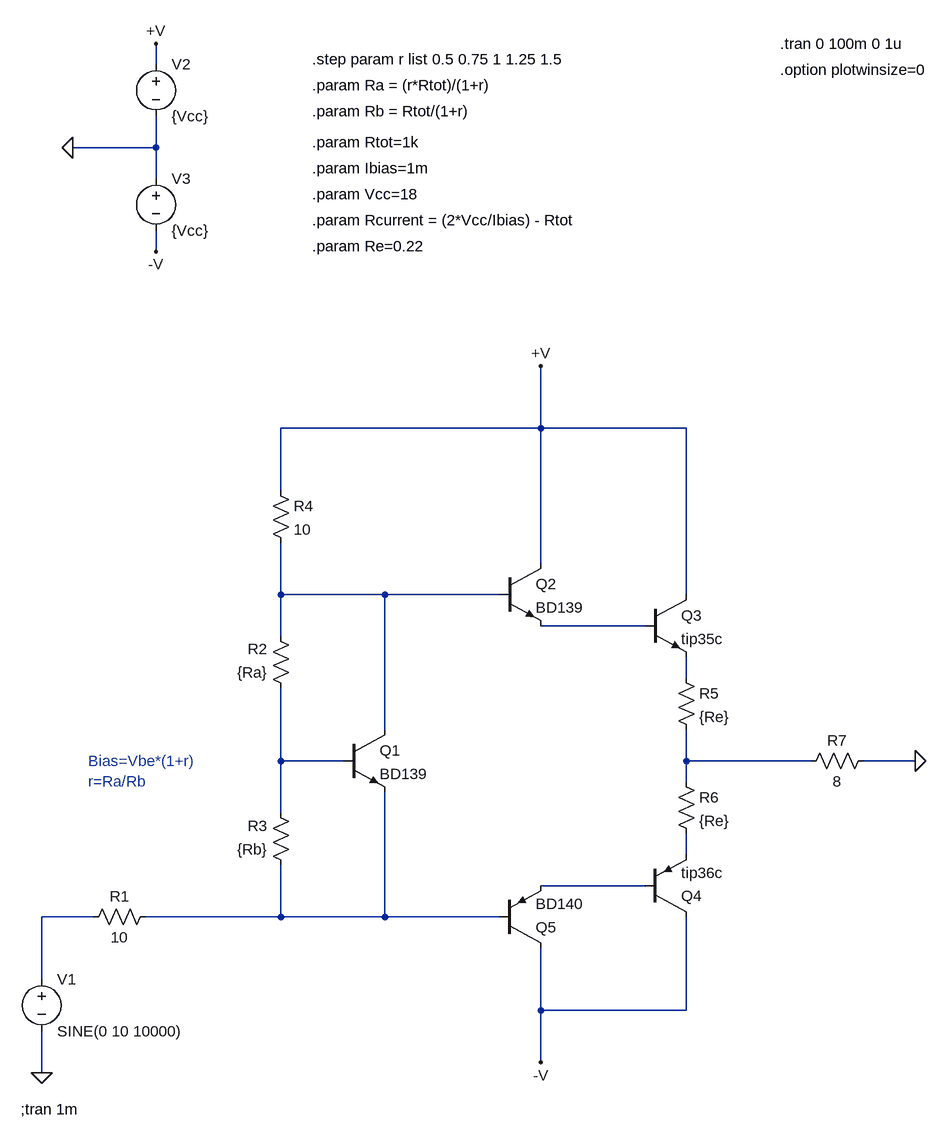
[diagram p0: schematic Bias voltage.asc]
Bias voltage.asc, the LTspice schematic file:
Version 4
SHEET 1 1524 680
WIRE 208 -976 208 -1008
WIRE 208 -848 208 -896
WIRE 208 -848 80 -848
WIRE 208 -800 208 -848
WIRE 208 -688 208 -720
WIRE 800 -416 800 -512
WIRE 800 -416 400 -416
WIRE 1024 -416 800 -416
WIRE 400 -320 400 -416
WIRE 800 -208 800 -416
WIRE 400 -160 400 -240
WIRE 560 -160 400 -160
WIRE 736 -160 560 -160
WIRE 1024 -160 1024 -416
WIRE 960 -112 800 -112
WIRE 400 -96 400 -160
WIRE 1024 -32 1024 -64
WIRE 560 48 560 -160
WIRE 400 96 400 -16
WIRE 496 96 400 96
WIRE 1024 96 1024 48
WIRE 1216 96 1024 96
WIRE 1376 96 1296 96
WIRE 1024 128 1024 96
WIRE 400 176 400 96
WIRE 1024 240 1024 208
WIRE 960 288 800 288
WIRE 112 336 32 336
WIRE 400 336 400 256
WIRE 400 336 192 336
WIRE 560 336 560 144
WIRE 560 336 400 336
WIRE 736 336 560 336
WIRE 32 432 32 336
WIRE 800 480 800 384
WIRE 1024 480 1024 336
WIRE 1024 480 800 480
WIRE 800 560 800 480
WIRE 32 576 32 512
FLAG 800 -512 +V
FLAG 800 560 -V
FLAG 32 576 0
FLAG 80 -848 0
FLAG 208 -1008 +V
FLAG 208 -688 -V
FLAG 1376 96 0
SYMBOL voltage 32 416 R0
WINDOW 123 0 0 Left 0
WINDOW 39 0 0 Left 0
SYMATTR InstName V1
SYMATTR Value SINE(0 10 10000)
SYMBOL res 208 320 R90
WINDOW 0 0 56 VBottom 2
WINDOW 3 32 56 VTop 2
SYMATTR InstName R1
SYMATTR Value 10
SYMBOL res 416 0 R180
WINDOW 0 36 76 Left 2
WINDOW 3 36 40 Left 2
SYMATTR InstName R2
SYMATTR Value {Ra}
SYMBOL res 416 272 R180
WINDOW 0 36 76 Left 2
WINDOW 3 36 40 Left 2
SYMATTR InstName R3
SYMATTR Value {Rb}
SYMBOL npn 496 48 R0
SYMATTR InstName Q1
SYMATTR Value BD139
SYMBOL npn 736 -208 R0
SYMATTR InstName Q2
SYMATTR Value BD139
SYMBOL npn 960 -160 R0
SYMATTR InstName Q3
SYMATTR Value tip35c
SYMBOL res 384 -336 R0
SYMATTR InstName R4
SYMATTR Value 10
SYMBOL pnp 960 336 M180
SYMATTR InstName Q4
SYMATTR Value tip36c
SYMBOL pnp 736 384 M180
SYMATTR InstName Q5
SYMATTR Value BD140
SYMBOL res 1008 -48 R0
SYMATTR InstName R5
SYMATTR Value {Re}
SYMBOL res 1008 112 R0
SYMATTR InstName R6
SYMATTR Value {Re}
SYMBOL voltage 208 -992 R0
WINDOW 123 0 0 Left 0
WINDOW 39 0 0 Left 0
SYMATTR InstName V2
SYMATTR Value {Vcc}
SYMBOL voltage 208 -816 R0
WINDOW 123 0 0 Left 0
WINDOW 39 0 0 Left 0
SYMATTR InstName V3
SYMATTR Value {Vcc}
SYMBOL res 1312 80 R90
WINDOW 0 0 56 VBottom 2
WINDOW 3 32 56 VTop 2
SYMATTR InstName R7
SYMATTR Value 8
TEXT 448 -944 Left 2 !.param Ra = (r*Rtot)/(1+r)
TEXT 104 96 Left 2 ;Bias=Vbe*(1+r)\nr=Ra/Rb
TEXT 448 -984 Left 2 !.step param r list 0.5 0.75 1 1.25 1.5
TEXT 448 -904 Left 2 !.param Rb = Rtot/(1+r)
TEXT 448 -856 Left 2 !.param Rtot=1k
TEXT 448 -816 Left 2 !.param Ibias=1m
TEXT 448 -776 Left 2 !.param Vcc=18
TEXT 448 -736 Left 2 !.param Rcurrent = (2*Vcc/Ibias) - Rtot
TEXT 448 -696 Left 2 !.param Re=0.22
TEXT 0 632 Left 2 !;tran 1m
TEXT 1168 -1008 Left 2 !.tran 0 100m 0 1u
TEXT 1168 -968 Left 2 !.option plotwinsize=0

The netlist it stands for:
* Bias voltage.asc
V1 N008 0 SINE(0 10 10000)
R1 N009 N008 10
R2 N004 N001 {Ra}
R3 N009 N004 {Rb}
Q1 N001 N004 N009 0 BD139
Q2 +V N001 N002 0 BD139
Q3 +V N002 N003 0 tip35c
R4 +V N001 10
Q4 -V N007 N006 0 tip36c
Q5 -V N009 N007 0 BD140
R5 N003 N005 {Re}
R6 N005 N006 {Re}
V2 +V 0 {Vcc}
V3 0 -V {Vcc}
R7 0 N005 8
.model NPN NPN
.model PNP PNP
.lib standard.bjt
.param Ra = (r*Rtot)/(1+r)
* Bias=Vbe*(1+r)
* r=Ra/Rb
.step param r list 0.5 0.75 1 1.25 1.5
.param Rb = Rtot/(1+r)
.param Rtot=1k
.param Ibias=1m
.param Vcc=18
.param Rcurrent = (2*Vcc/Ibias) - Rtot
.param Re=0.22
;tran 1m
.tran 0 100m 0 1u
.option plotwinsize=0
.backanno
.end